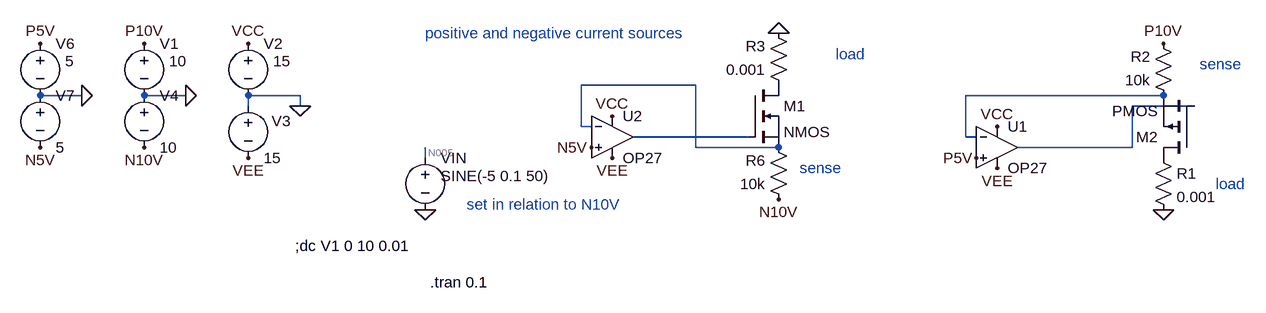
[diagram p0: schematic Draft29.asc]
Draft29.asc, the LTspice schematic file:
Version 4
SHEET 1 1460 680
WIRE 544 16 368 16
WIRE -400 32 -464 32
WIRE -240 32 -304 32
WIRE -64 32 -144 32
WIRE 1264 32 960 32
WIRE -144 48 -144 32
WIRE -64 48 -64 32
WIRE 1312 48 1216 48
WIRE 368 80 368 16
WIRE 384 80 368 80
WIRE 624 96 448 96
WIRE 960 96 960 32
WIRE 976 96 960 96
WIRE 544 112 544 16
WIRE 672 112 544 112
WIRE 1216 112 1216 48
WIRE 1216 112 1040 112
WIRE 128 128 128 112
FLAG 128 208 0
FLAG -64 48 0
FLAG -144 -48 VCC
FLAG 416 64 VCC
FLAG -144 128 VEE
FLAG 416 128 VEE
FLAG -240 32 0
FLAG 1264 -48 P10V
FLAG -304 112 N10V
FLAG 672 -64 0
FLAG 672 192 N10V
FLAG -400 32 0
FLAG -464 -48 P5V
FLAG -464 112 N5V
FLAG 384 112 N5V
FLAG 1008 80 VCC
FLAG 1008 144 VEE
FLAG 1264 208 0
FLAG 976 128 P5V
FLAG -304 -48 P10V
SYMBOL voltage 128 112 R0
WINDOW 123 0 0 Left 0
WINDOW 39 0 0 Left 0
WINDOW 3 24 44 Left 2
SYMATTR Value SINE(-5 0.1 50)
SYMATTR InstName VIN
SYMBOL voltage -144 -64 R0
WINDOW 123 0 0 Left 0
WINDOW 39 0 0 Left 0
WINDOW 3 38 43 Left 2
SYMATTR Value 15
SYMATTR InstName V2
SYMBOL voltage -144 32 R0
WINDOW 123 0 0 Left 0
WINDOW 39 0 0 Left 0
WINDOW 0 36 39 Left 2
SYMATTR InstName V3
SYMATTR Value 15
SYMBOL res 688 32 R180
WINDOW 0 36 76 Left 2
WINDOW 3 36 40 Left 2
SYMATTR InstName R3
SYMATTR Value 0.001
SYMBOL OpAmps\\OP27 416 32 R0
SYMATTR InstName U2
SYMBOL voltage -304 -64 R0
WINDOW 123 0 0 Left 0
WINDOW 39 0 0 Left 0
WINDOW 3 38 43 Left 2
SYMATTR Value 10
SYMATTR InstName V1
SYMBOL voltage -304 16 R0
WINDOW 123 0 0 Left 0
WINDOW 39 0 0 Left 0
SYMATTR InstName V4
SYMATTR Value 10
SYMBOL res 688 208 R180
WINDOW 0 36 76 Left 2
WINDOW 3 36 40 Left 2
SYMATTR InstName R6
SYMATTR Value 10k
SYMBOL nmos 624 16 R0
SYMATTR InstName M1
SYMBOL voltage -464 -64 R0
WINDOW 123 0 0 Left 0
WINDOW 39 0 0 Left 0
WINDOW 3 38 43 Left 2
SYMATTR Value 5
SYMATTR InstName V6
SYMBOL voltage -464 16 R0
WINDOW 123 0 0 Left 0
WINDOW 39 0 0 Left 0
SYMATTR InstName V7
SYMATTR Value 5
SYMBOL res 1248 112 R0
SYMATTR InstName R1
SYMATTR Value 0.001
SYMBOL OpAmps\\OP27 1008 48 R0
SYMATTR InstName U1
SYMBOL res 1280 48 R180
WINDOW 0 36 76 Left 2
WINDOW 3 36 40 Left 2
SYMATTR InstName R2
SYMATTR Value 10k
SYMBOL pmos 1312 128 R180
SYMATTR InstName M2
TEXT -72 264 Left 2 !;dc V1 0 10 0.01
TEXT 136 320 Left 2 !.tran 0.1
TEXT 704 144 Left 2 ;sense
TEXT 760 -32 Left 2 ;load
TEXT 192 200 Left 2 ;set in relation to N10V
TEXT 1320 -16 Left 2 ;sense
TEXT 1344 168 Left 2 ;load
TEXT 128 -64 Left 2 ;positive and negative current sources

The netlist it stands for:
* Draft29.asc
VIN N005 0 SINE(-5 0.1 50)
V2 VCC 0 15
V3 0 VEE 15
R3 P001 0 0.001
XU2 N5V N001 VCC VEE N004 OP27  ; pins In+ In- V+ V- OUT
V1 P10V 0 10
V4 0 N10V 10
R6 N10V N001 10k
M1 P001 N004 N001 N001 NMOS
V6 P5V 0 5
V7 0 N5V 5
R1 P002 0 0.001
XU1 P5V N002 VCC VEE N003 OP27  ; pins In+ In- V+ V- OUT
R2 N002 P10V 10k
M2 P002 N003 N002 N002 PMOS
.model NMOS NMOS
.model PMOS PMOS
.lib standard.mos
;dc V1 0 10 0.01
.tran 0.1
* sense
* load
* set in relation to N10V
* sense
* load
* positive and negative current sources
.lib ADI.lib
.backanno
.end

* Results of the author's LTspice run, read from the files saved beside the schematic
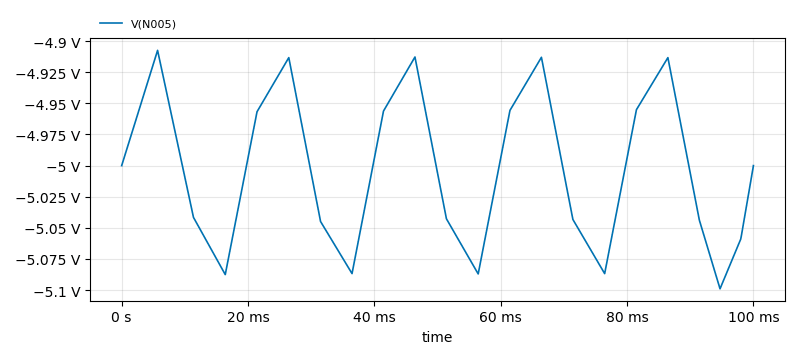
[diagram p1: Transient Analysis of Draft29.asc, plotted from the saved traces]
* Transient Analysis, 1 run:
*   V(N005): min -5.099 V, max -4.907 V, average -5.001 V, rms 5.002 V, last -5 V